# EAGLE design stepper_module (EAGLE 7.6.0)
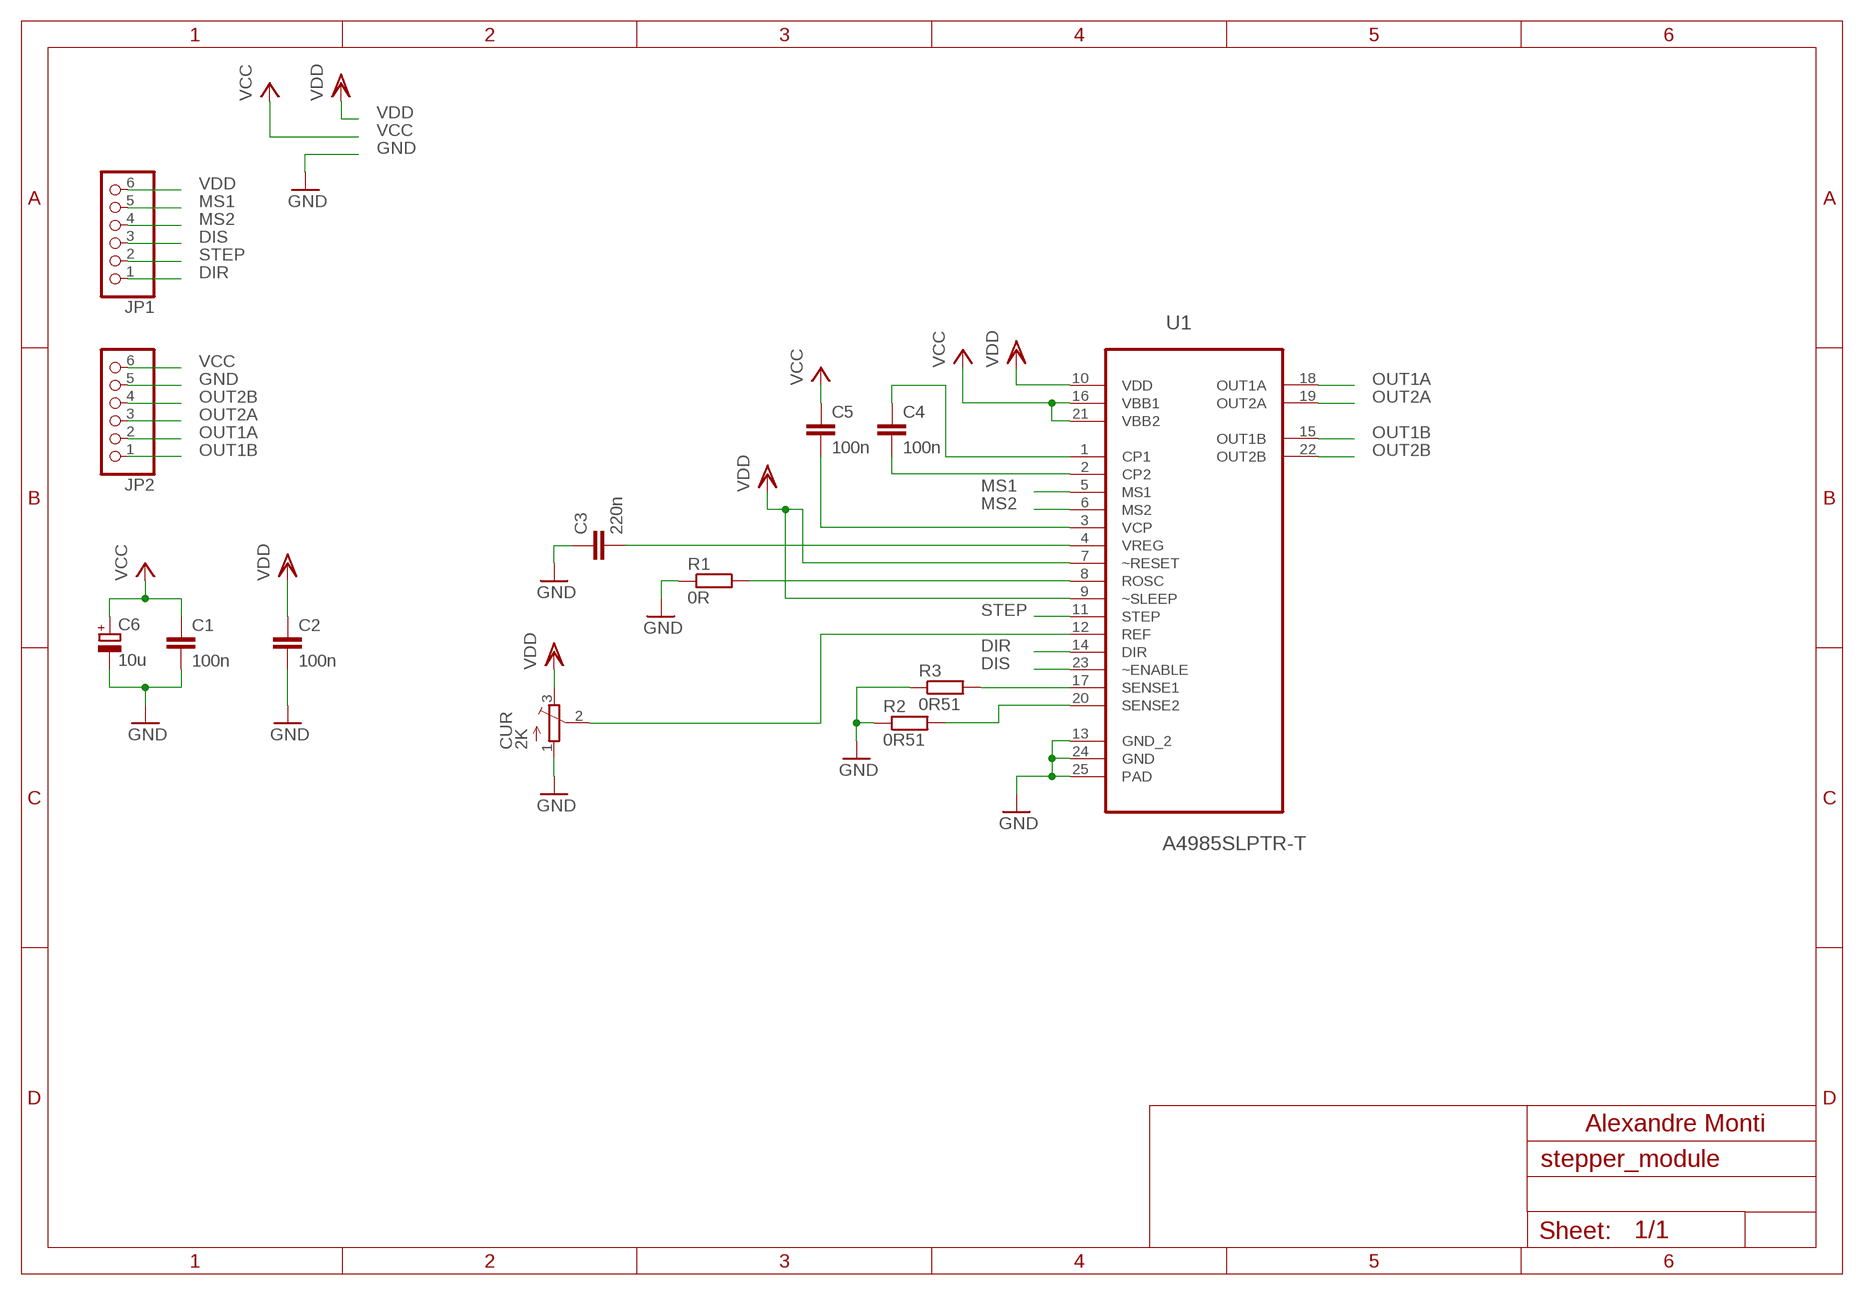
[diagram p0: schematic, sheet 1]

## Parts
C1  100n  C-EUC0805  [C0805]
C2  100n  C-EUC0805  [C0805]
C3  220n  C-EUC0805  [C0805]
C4  100n  C-EUC0805  [C0805]
C5  100n  C-EUC0805  [C0805]
C6  10u  CPOL-EUSMCB  [SMC_B]
CUR  2K  TRIMPOTTC33X  [TC33X]
JP1  PINHD-1X6  [1X06]
JP2  PINHD-1X6  [1X06]
R1  0R  R-EU_R0805  [R0805]
R2  0R51  R-EU_R0805  [R0805]
R3  0R51  R-EU_R0805  [R0805]
U1  A4985SLPTR-T  [SOP65P640X120-25N]

## Nets
DIR: JP1.1 U1.14(DIR)
DIS: JP1.3 U1.23(~ENABLE)
GND: C1.2 C2.2 C3.1 C6.- CUR.1(A) JP2.5 R1.1 R2.1 R3.1 U1.13(GND_2) U1.24(GND) U1.25(PAD)
MS1: JP1.5 U1.5(MS1)
MS2: JP1.4 U1.6(MS2)
N$1: C4.2 U1.2(CP2)
N$2: C4.1 U1.1(CP1)
N$3: C5.2 U1.3(VCP)
N$4: C3.2 U1.4(VREG)
N$5: R3.2 U1.17(SENSE1)
N$6: R2.2 U1.20(SENSE2)
N$7: R1.2 U1.8(ROSC)
N$8: CUR.2(S) U1.12(REF)
OUT1A: JP2.2 U1.18(OUT1A)
OUT1B: JP2.1 U1.15(OUT1B)
OUT2A: JP2.3 U1.19(OUT2A)
OUT2B: JP2.4 U1.22(OUT2B)
STEP: JP1.2 U1.11(STEP)
VCC: C1.1 C5.1 C6.+ JP2.6 U1.16(VBB1) U1.21(VBB2)
VDD: C2.1 CUR.3(E) JP1.6 U1.7(~RESET) U1.9(~SLEEP) U1.10(VDD)

## Notes on the sheet
- Alexandre Monti

## Library data of the parts
C1 C2 C4 C5 = rcl:C-EU: CAPACITOR, European symbol; OC_FARNELL: 2407344
C3 = rcl:C-EU: CAPACITOR, European symbol; OC_FARNELL: 1759172RL
C6 = rcl:CPOL-EU: POLARIZED CAPACITOR, European symbol; OC_FARNELL: 2353056
CUR = adafruit:TRIMPOT: SMT trimmer potentiometer part number TC33X http://www.ladyada.net/library/eagle; OC_FARNELL: 1689865
JP1 JP2 = pinhead:PINHD-1X6: PIN HEADER; OC_FARNELL: 1022255
R1 = rcl:R-EU_: RESISTOR, European symbol; OC_FARNELL: 2008388
R2 R3 = rcl:R-EU_: RESISTOR, European symbol; OC_FARNELL: 1865236
U1 = Allegro_By_element14_Batch_1:A4985SLPTR-T: DMOS Microstepping Driver with Translator and Overcurrent Protection; MPN: A4985SLPTR-T; OC_FARNELL: 2057416; OC_NEWARK: 67R9674; PACKAGE: TSSOP-24; SUPPLIER: Allegro

## Board
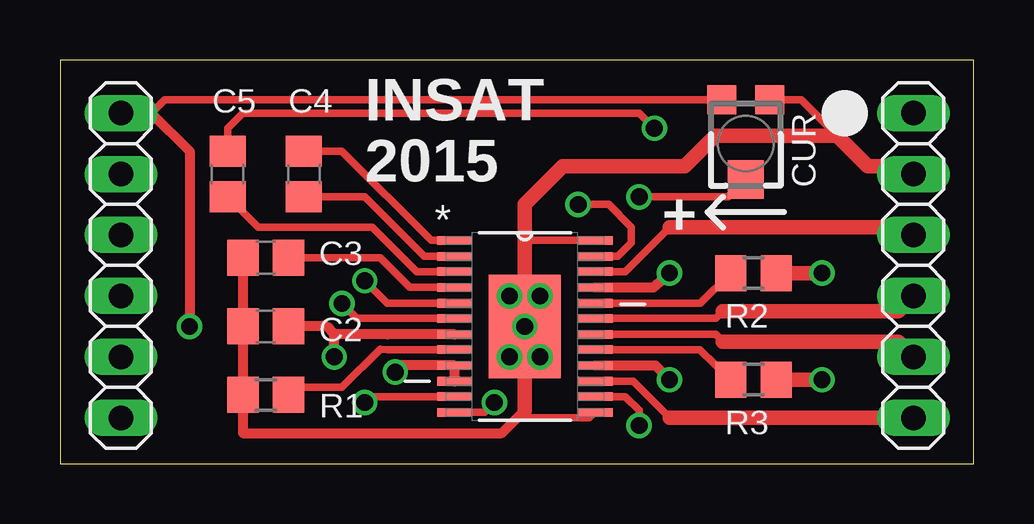
[diagram p1: board, top side]
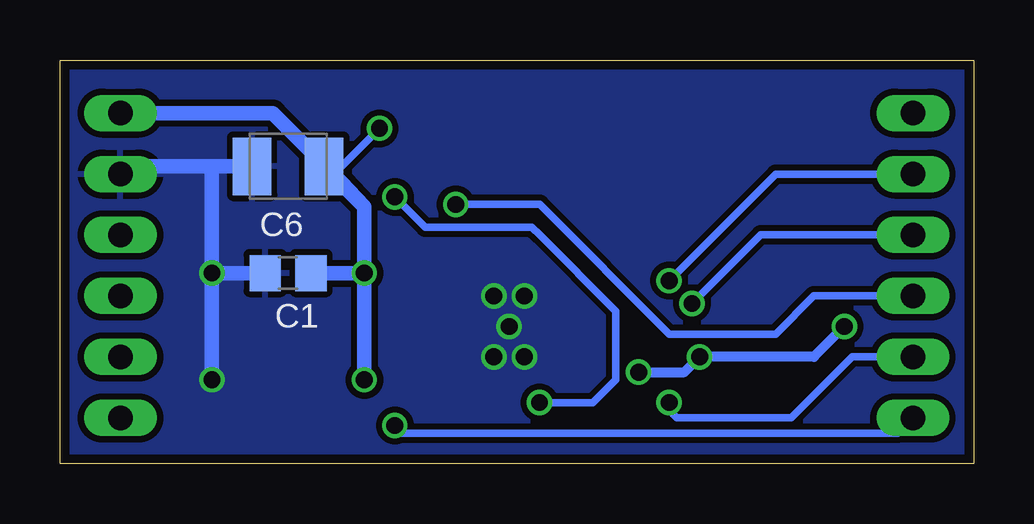
[diagram p2: board, bottom side, seen from below]

Size 38.08 x 16.81 mm. Coordinates in mm from the lower left corner, seen from the top.
Outline: 0,0 38.08,0 38.08,16.81 0,16.81 0,0
Copper layers (1*16): Top 0.0356mm / dielectric 1.5011mm / Bottom 0.0356mm
Design rules "default": minimum track width 6mil, minimum drill 13mil, track to track 6mil, track to pad 6mil, pad to pad 6mil, via to via 6mil, smd to smd 6mil, copper to edge 15mil, drill to drill 6mil, minimum pad ring 7mil, minimum via ring 7mil, stop-mask expansion 3mil, vias tented up to drill 0mil, thermal gap 10mil

### Footprints (pad centres in the part's own frame; a part is rotated, then mirrored left to right if it is on the bottom)
C0805 = smd 1.3 x 1.5: 1 -0.95,0; 2 0.95,0
SMC_B = smd 1.6 x 2.4: + -1.5,0; - 1.5,0
TC33X = smd 1.2 x 1.2: 1 -1,-1.825; 3 1,-1.825 | smd 1.5 x 1.6: 2 0,1.5
1X06 = drill 1.016 long: 1 -6.35,0; 2 -3.81,0; 3 -1.27,0; 4 1.27,0; 5 3.81,0; 6 6.35,0
R0805 = smd 1.3 x 1.5: 1 -0.95,0; 2 0.95,0
SOP65P640X120-25N = smd 1.473 x 0.356: 1 -2.921,3.581; 2 -2.921,2.921; 3 -2.921,2.286; 4 -2.921,1.626; 5 -2.921,0.965; 6 -2.921,0.33; 7 -2.921,-0.33; 8 -2.921,-0.965; 9 -2.921,-1.626; 10 -2.921,-2.286; 11 -2.921,-2.921; 12 -2.921,-3.581; 13 2.921,-3.581; 14 2.921,-2.921; 15 2.921,-2.286; 16 2.921,-1.626; 17 2.921,-0.965; 18 2.921,-0.33; 19 2.921,0.33; 20 2.921,0.965; 21 2.921,1.626; 22 2.921,2.286; 23 2.921,2.921; 24 2.921,3.581 | smd 2.997 x 4.318: 25 0,0

### Placement (x,y rotation side)
C1  28.57,7.94 180 bottom
C2  8.57,5.72 180 top
C3  8.57,8.57 0 top
C4  10.16,12.06 270 top
C5  6.98,12.06 270 top
C6  28.57,12.38 180 bottom
CUR  28.57,13.34 180 top
JP1  2.54,8.25 90 top
JP2  35.56,8.25 90 top
R1  8.57,2.86 0 top
R2  28.89,7.94 180 top
R3  28.89,3.49 180 top
U1  19.37,5.72 0 top

### Tracks (layer width: path | path; a pad name or v marks a point on that pad's centre or on a via)
DIR  (via drill 0.7)
  Top 0.305: U1.14 23.56,2.79 24.13,2.22 v24.13,1.59
  Bottom 0.305: v24.13,1.59 23.81,1.27 3.17,1.27 JP1.1
DIS  (via drill 0.7)
  Top 0.305: U1.23 23.24,8.64 23.81,9.21 23.81,9.84 22.86,10.79 v21.59,10.79
  Bottom 0.305: v21.59,10.79 18.1,10.79 12.7,5.4 8.26,5.4 6.67,6.99 JP1.3
GND  (via drill 0.7)
  Top 0.254: v18.73,4.44 v20,4.44 19.37,5.08 U1.25 19.37,6.35 v18.73,6.99 v20,6.99
  Top 0.305: CUR.1 30.88,15.16 33.65,12.38 | 19.37,2.22 19.37,1.91 22.06,1.91 U1.13 | U1.24 19.6,9.3 19.37,9.52
  Top 0.406: C3.1 C2.2 | C2.2 R1.1 | C2.2 7.62,1.27 18.41,1.27 19.37,2.22
  Top 0.61: R2.1 v31.75,7.94 | v31.75,3.49 R3.1 | 19.37,2.22 U1.25 19.37,9.52 19.37,10.79 20.96,12.38 26.04,12.38 27.3,13.65 32.39,13.65 33.65,12.38 35.24,12.38 JP2.5
  Bottom 0.61: v31.75,7.94 31.75,12.38 | 31.75,12.38 C6.- | v31.75,7.94 v31.75,3.49 | 31.75,12.38 35.24,12.38 JP2.5 | C1.2 v31.75,7.94
  other vias: 19.37,5.72
  pour Bottom (isolate 0.254): 0,16.83 38.1,16.83 38.1,0 0,0
MS1  (via drill 0.7)
  Top 0.305: U1.5 13.64,6.68 v12.7,7.62
  Bottom 0.305: v12.7,7.62 8.26,12.06 JP1.5
MS2  (via drill 0.7)
  Top 0.305: U1.6 12.37,6.05 v11.75,6.67
  Bottom 0.305: v11.75,6.67 8.89,9.52 JP1.4
N$1
  Top 0.305: U1.2 15.18,8.64 12.7,11.11 C4.2
N$2
  Top 0.305: U1.1 15.47,9.3 11.75,13.02 11.11,13.02 C4.1
N$3
  Top 0.305: U1.3 14.86,8 13.02,9.84 8.26,9.84 C5.2
N$4
  Top 0.305: U1.4 14.57,7.34 13.33,8.57 C3.2
N$5
  Top 0.305: U1.17 26.66,4.75 R3.2
N$6
  Top 0.305: U1.20 26.69,6.68 R2.2
N$7
  Top 0.305: U1.8 13.65,4.75 13.33,4.76 11.75,3.17 9.84,3.17 R1.2
  Top 0.61: R1.2
N$8  (via drill 0.7)
  Top 0.305: U1.12 17.69,2.13 v18.1,2.54 | v24.13,11.11 27.85,11.11 CUR.2
  Bottom 0.305: v18.1,2.54 15.87,2.54 14.92,3.49 14.92,6.35 18.1,9.52 18.41,9.84 22.86,9.84 v24.13,11.11
OUT1A
  Top 0.305: U1.18 27.32,5.38 27.62,5.08
  Top 0.61: 27.62,5.08 34.93,5.08 JP2.2
OUT1B
  Top 0.305: U1.15 23.88,3.43 25.4,1.91
  Top 0.61: 25.4,1.91 JP2.1
OUT2A
  Top 0.305: U1.19 27.32,6.05 27.62,6.35
  Top 0.61: 27.62,6.35 34.93,6.35 JP2.3
OUT2B
  Top 0.305: U1.22 23.56,8 25.4,9.84
  Top 0.61: 25.4,9.84 35.24,9.84 JP2.4
STEP  (via drill 0.7)
  Top 0.305: U1.11 12.95,2.79 v12.7,2.54
  Bottom 0.305: v12.7,2.54 12.7,2.22 12.38,1.91 7.62,1.91 5.08,4.44 JP1.2
VCC  (via drill 0.7)
  Top 0.305: C5.1 6.99,13.97 7.62,14.61 24.13,14.61 v24.76,13.97
  Top 0.406: U1.21 24.73,7.34 v25.4,7.94 | U1.16 24.8,4.09 v25.4,3.49
  Bottom 0.305: v24.76,13.97 26.71,12.02
  Bottom 0.61: v25.4,7.94 v25.4,3.49 | v25.4,7.94 25.4,10.71 | JP2.6 29.21,14.61 26.67,12.06 25.4,10.71 | C1.1 v25.4,7.94 | 25.4,10.71 26.71,12.02 C6.+
VDD  (via drill 0.7)
  Top 0.305: 13.65,5.38 13.65,5.4 | CUR.3 4.36,15.16 3.81,14.61
  Top 0.406: U1.7 13.65,5.38 | 13.65,5.4 11.43,5.4 | C2.1 11.11,5.72 11.43,5.4 | U1.10 U1.9 14.25,4.09 v13.97,3.81 | v11.43,4.44 11.43,5.4 | JP1.6 3.81,14.61 5.4,13.02 v5.4,5.72
  Bottom 0.406: v13.97,3.81 12.07,3.81 v11.43,4.44 6.67,4.44 v5.4,5.72

### Text on the board
tPlace: INSAT | 2015 | +